# EAGLE design stepper1 (EAGLE 6.6.0)
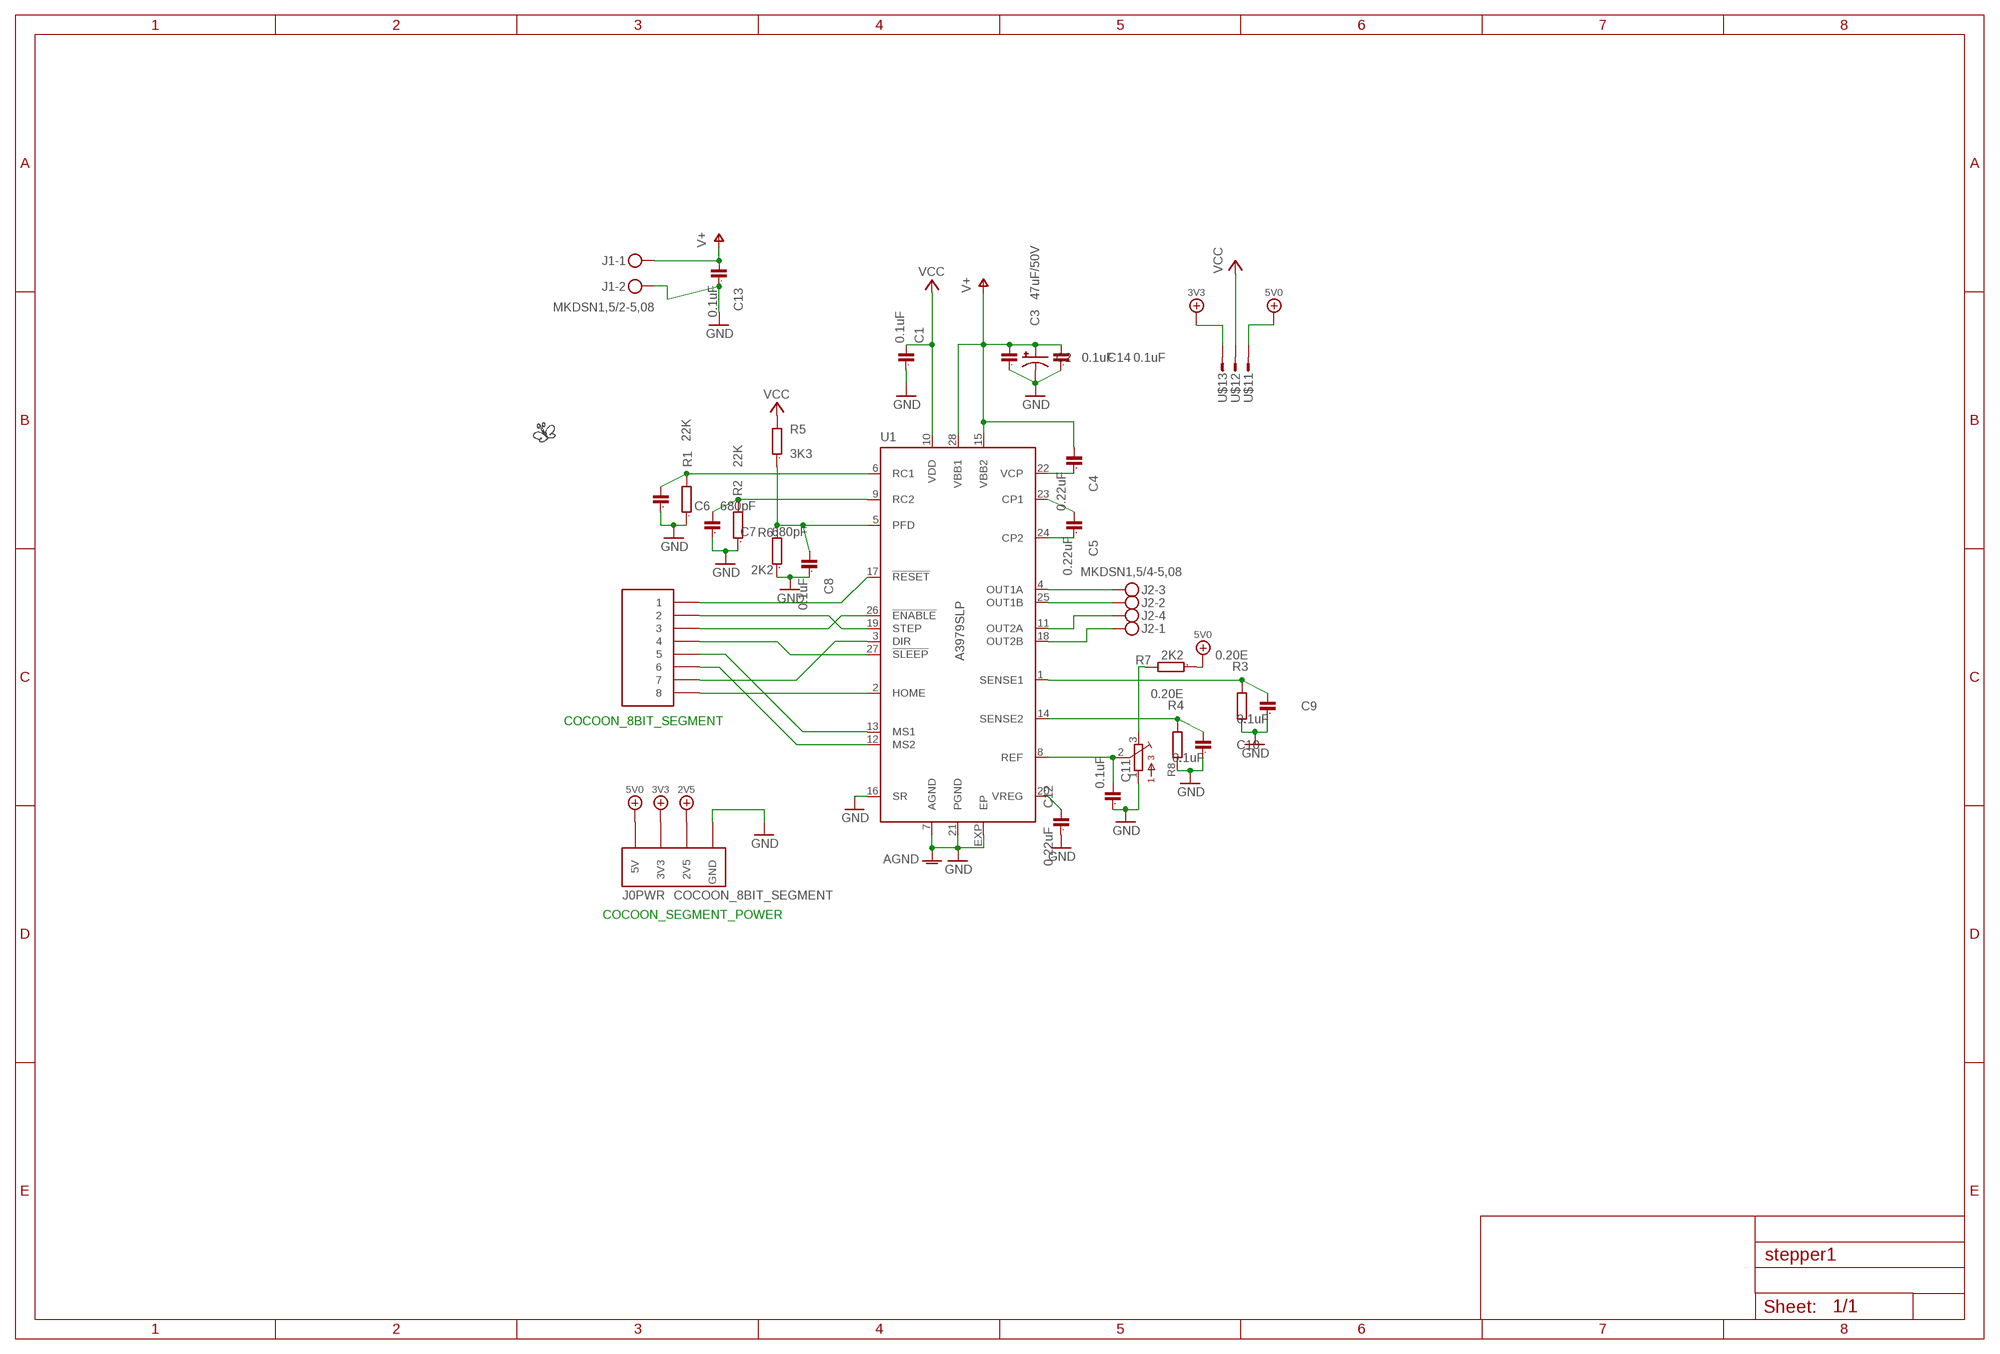
[diagram p0: schematic, sheet 1]

## Parts
C1  0.1uF  C0603  [0603]
C2  0.1uF  C0805  [0805]
C3  47uF/50V  CPOL-USE2.5-7  [E2,5-7]
C4  0.22uF  C0805  [0805]
C5  0.22uF  C0805  [0805]
C6  680pF  C0603  [0603]
C7  680pF  C0603  [0603]
C8  0.1uF  C0603  [0603]
C9  0.1uF  C0805  [0805]
C10  0.1uF  C0805  [0805]
C11  0.1uF  C0603  [0603]
C12  0.22uF  C0805  [0805]
C13  0.1uF  C0805  [0805]
C14  0.1uF  C0805  [0805]
J0  COCOON_8BIT_SEGMENT  [COCOON_8BIT_SEGMENT]
J1  MKDSN1,5/2-5,08  [MKDSN1,5/2-5,08]
J2  MKDSN1,5/4-5,08  [MKDSN1,5/4-5,08]
LOGO1  BUTTERFLY_LOGO  [BUTTERFLY_LOGO]
R1  22K  R0603  [0603]
R2  22K  R0603  [0603]
R3  0.20E  R2512  [2512]
R4  0.20E  R2512  [2512]
R5  3K3  R0603  [0603]
R6  2K2  R0603  [0603]
R7  2K2  R0603  [0603]
R8  3386-P  [3386P]
U1  A3979SLP  [TSSOP28]
U$1  JPS3X1  [JP3X1]

## Nets
2V5: J0.2V5(PWR:2V5)
3V3: J0.3V3(PWR:3V3) U$1.3
5V0: J0.5V(PWR:5V) R7.1 U$1.1
GND: C1.1 C2.1 C3.- C6.1 C7.1 C8.1 C9.1 C10.1 C11.1 C12.1 C13.1 C14.1 J0.GND(PWR:GND) J1.2 R1.1 R2.1 R3.1 R4.1 R6.1 R8.1 U1.7(AGND) U1.16(SR) U1.21(PGND) U1.EXP(EP) ; supply symbol labelled AGND
N$1: R7.2 R8.3
N$2: C6.2 R1.2 U1.6(RC1)
N$3: C7.2 R2.2 U1.9(RC2)
N$4: J0.6 U1.12(MS2)
N$5: C4.1 U1.22(VCP)
N$6: J0.4 U1.27(!SLEEP)
N$7: C11.2 R8.2 U1.8(REF)
N$8: C9.2 R3.2 U1.1(SENSE1)
N$9: C10.2 R4.2 U1.14(SENSE2)
N$10: C12.2 U1.20(VREG)
N$11: J0.3 U1.26(!ENABLE)
N$12: J0.2 U1.19(STEP)
N$13: J0.1 U1.17(!RESET)
N$14: C5.1 U1.24(CP2)
N$15: C5.2 U1.23(CP1)
N$17: J0.8 U1.2(HOME)
N$18: J0.5 U1.13(MS1)
N$19: J0.7 U1.3(DIR)
N$20: C8.2 R5.1 R6.2 U1.5(PFD)
OUT1A: J2.3 U1.4(OUT1A)
OUT1B: J2.2 U1.25(OUT1B)
OUT2A: J2.4 U1.11(OUT2A)
OUT2B: J2.1 U1.18(OUT2B)
V+: C2.2 C3.+ C4.2 C13.2 C14.2 J1.1 U1.15(VBB2) U1.28(VBB1)
VCC: C1.2 R5.2 U1.10(VDD) U$1.2

## Notes on the sheet
- COCOON_8BIT_SEGMENT
- COCOON_SEGMENT_POWER

## Library data of the parts
C1 C2 C4-C14 = GadgetFactory:C: CAPACITOR, European symbol
C3 = GadgetFactory:CPOL-US: POLARIZED CAPACITOR, American symbol
J0 = GadgetFactory_Pub6:COCOON_8BIT_SEGMENT
J1 = usb1:MKDSN1,5/2-5,08: MKDSN 1,5/ 2-5,08 Printklemme Nennstrom: 13,5 A Nennspannung: 250 V Rastermaß: 5,08 mm Polzahl: 2 Anschlussart: Schraubanschluss Montage: Löten Anschlussrichtung Leiter/Platine: 0 ° Artikelnummer: 1729128 Source: http://eshop.phoenixcontact.com .. 1729128.pdf
J2 = usb1:MKDSN1,5/4-5,08: MKDSN 1,5/ 4-5,08 Printklemme Nennstrom: 13,5 A Nennspannung: 250 V Rastermaß: 5,08 mm Polzahl: 4 Anschlussart: Schraubanschluss Montage: Löten Anschlussrichtung Leiter/Platine: 0 ° Artikelnummer: 1729144 Source: http://eshop.phoenixcontact.com .. 1729144.pdf
LOGO1 = usb1:BUTTERFLY_LOGO
R1-R7 = GadgetFactory:R: RESISTOR, European symbol
R8 = GadgetFactory:3386-: 3386 Series 3/8" Square Trimmer
U1 = stepper:A3979SLP
U$1 = stepper:JPS3X1

## Board
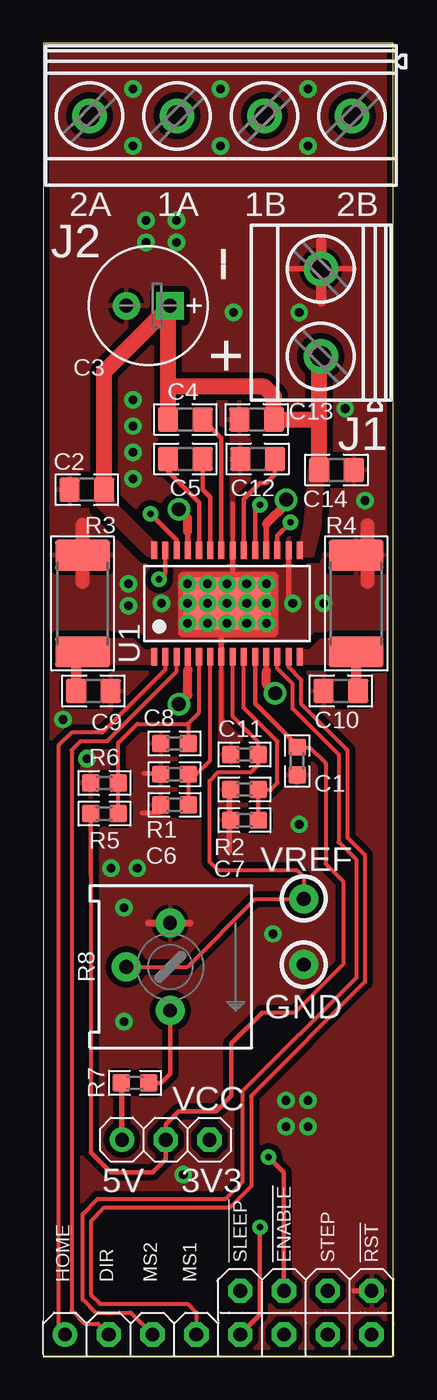
[diagram p1: board, top side]
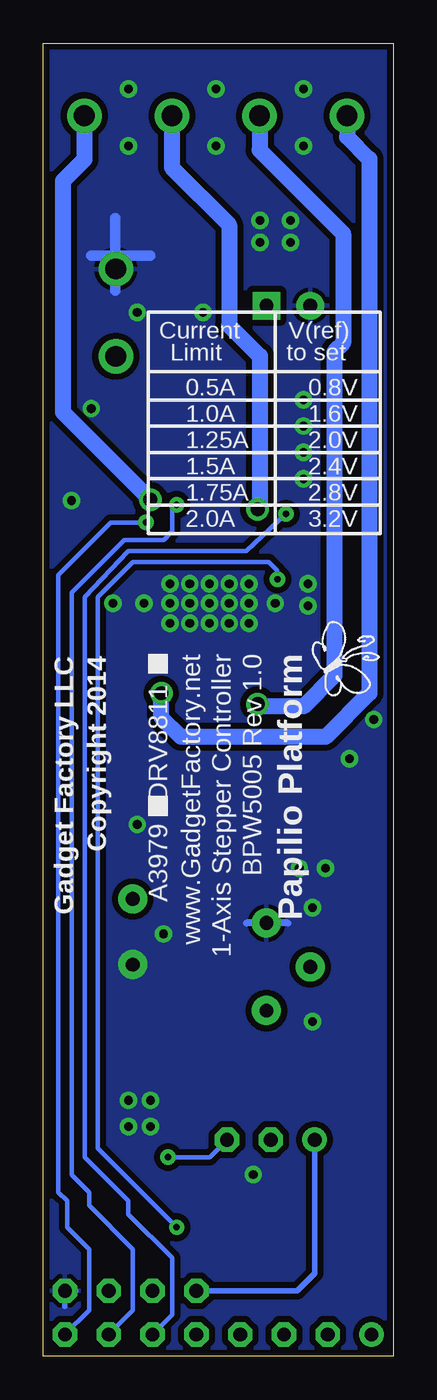
[diagram p2: board, bottom side, seen from below]

Size 20.32 x 76.2 mm. Coordinates in mm from the lower left corner, seen from the top.
Outline: 0,0 20.32,0 20.32,76.2 0,76.2 0,0
Copper layers (1*16): Top 0.035mm / dielectric 1.5mm / Bottom 0.035mm
Design rules "SparkFun_Derived_GoldePheonix_7mil": minimum track width 7mil, minimum drill 15mil, track to track 7mil, track to pad 7mil, pad to pad 7mil, via to via 7mil, smd to smd 7mil, copper to edge 7mil, drill to drill 7mil, minimum pad ring 12mil, minimum via ring 10mil, stop-mask expansion 4mil, vias tented up to drill 18mil, thermal gap 10mil

### Footprints (pad centres in the part's own frame; a part is rotated, then mirrored left to right if it is on the bottom)
0603 = smd 1 x 1: 1 -0.8,0; 2 0.8,0
0805 = smd 1.2 x 1.4: 1 -1,0; 2 1,0
E2,5-7 = drill 0.8 pad 1.6 square: + -1.27,0 | drill 0.8 pad 1.6: - 1.27,0
COCOON_8BIT_SEGMENT = drill 0.8 octagon: 1 -1.27,-8.89; 2 -1.27,-6.35; 2V5 1.27,-6.35; 3 -1.27,-3.81; 3V3 1.27,-3.81; 4 -1.27,-1.27; 5 -1.27,1.27; 5V 1.27,-1.27; 6 -1.27,3.81; 7 -1.27,6.35; GND 1.27,-8.89 | drill 0.8: 8 -1.27,8.89
MKDSN1,5/2-5,08 = drill 1.2 pad 2: 1 -2.561,0.025; 2 2.519,0.025
MKDSN1,5/4-5,08 = drill 1.2 pad 2: 1 -7.641,0.025; 2 -2.561,0.025; 3 2.519,0.025; 4 7.599,0.025
2512 = smd 1.8 x 3.2: 1 -2.8,0; 2 2.8,0
3386P = drill 0.8 pad 1.676: 1 -2.54,0; 2 0,-2.54; 3 2.54,0
TSSOP28 = smd 0.35 x 1: 1 -4.225,-3.087; 2 -3.575,-3.087; 3 -2.925,-3.087; 4 -2.275,-3.087; 5 -1.625,-3.087; 6 -0.975,-3.087; 7 -0.325,-3.087; 8 0.325,-3.087; 9 0.975,-3.087; 10 1.625,-3.087; 11 2.275,-3.087; 12 2.925,-3.087; 13 3.575,-3.087; 14 4.225,-3.087; 15 4.225,3.087; 16 3.575,3.087; 17 2.925,3.087; 18 2.275,3.087; 19 1.625,3.087; 20 0.975,3.087; 21 0.325,3.087; 22 -0.325,3.087; 23 -0.975,3.087; 24 -1.625,3.087; 25 -2.275,3.087; 26 -2.925,3.087; 27 -3.575,3.087; 28 -4.225,3.087 | smd 5 x 3: EXP 0,0
JP3X1 = drill 0.8: 1 0,2.54 | drill 0.8 octagon: 2 0,0; 3 0,-2.54

### Placement (x,y rotation side)
C1  14.73,34.54 90 top
C2  2.54,50.29 0 top
C3  6.1,60.96 180 top
C4  8.25,54.36 180 top
C5  8.25,52.07 0 top
C6  7.62,32 0 top
C7  11.68,31.12 0 top
C8  7.62,35.56 0 top
C9  2.92,38.61 180 top
C10  17.27,38.61 0 top
C11  11.68,34.92 0 top
C12  12.45,52.07 0 top
C13  12.38,54.36 0 top
C14  17.02,51.43 180 top
J0  10.16,2.54 90 top
J1  16.13,60.58 90 top
J2  10.29,72.01 180 top
LOGO1  3.3,40.39 270 bottom
R1  7.62,33.78 0 top
R2  11.68,32.89 0 top
R3  2.29,43.69 270 top
R4  18.16,43.69 270 top
R5  3.56,31.5 180 top
R6  3.56,33.27 0 top
R7  5.33,15.87 0 top
R8  7.37,22.61 270 top
U1  10.67,43.69 0 top
U$1  7.11,12.57 90 top

### Tracks (layer width: path | path; a pad name or v marks a point on that pad's centre or on a via)
3V3  (via drill 0.38)
  Top 0.254: J0.3V3 13.97,10.67 v13.08,11.56
  Bottom 0.254: v13.08,11.56 10.67,11.56 U$1.3
5V0
  Top 0.305: U$1.1 4.57,15.84 R7.1
  Bottom 0.305: J0.5V 5.59,3.81 4.57,4.83 U$1.1
GND  (via drill 0.5, 0.8 pad 1.68)
  Top 0.254: 10.34,36.65 U1.7 | U1.21 10.99,49.47 | 6.86,33.82 5.84,33.82 | 6.73,31.54 5.71,31.54
  Top 0.305: 14.24,43.71 U1.16 | 18.03,3.81 19.43,3.81 | 14.22,63.12 18.03,63.12 | 10.79,29.34 10.79,32.89 | U1.21 10.99,44.83 v10.67,44.83 | U1.7 10.34,42.54 v10.67,42.54 | 8.13,44.83 v8.38,44.83
  Top 0.406: 6.12,25.15 8.53,25.15
  Top 0.61: 16.13,61.21 16.13,64.64 | 13.33,42.16 13.33,45.21 8.13,45.21 8.13,44.83 8.13,42.04 13.33,42.04
  Top 0.813: 2.29,44.96 2.29,48.26 | 18.82,44.93 18.82,48.23
  Bottom 0.305: J0.GND 19.05,2.92 | J0.GND 18.42,3.81 | J0.GND 19.56,3.81
  Bottom 0.406: 6.12,25.15 8.53,25.15
  Bottom 0.61: 16.13,61.85 16.13,66.04 | 14.1,63.88 17.53,63.88
  other vias: 5.46,28.32 15.37,70.23 5.21,53.97 4.7,26.04 8.38,42.54 8.38,43.69 11.81,42.54 9.52,42.54 5.21,73.53 12.95,42.54 14.48,43.69 6.86,43.69 15.37,73.53 7.75,65.91 15.37,13.33 3.94,28.32 8.13,10.54 5.21,50.93 9.52,43.69 10.67,43.69 11.81,43.69 12.95,43.69 9.52,44.83 11.81,44.83 12.95,44.83 16.26,43.69 4.95,43.56 13.33,24.51 14.1,14.86 5.97,64.64 11.05,60.58 14.1,13.33 15.37,14.86 5.97,65.91 18.67,49.66 7.75,64.64 10.29,73.53 14.86,60.58 5.21,52.45 10.29,70.23 4.7,19.43 2.54,34.67 17.53,54.99 5.21,55.5 1.14,36.96 14.86,30.86 4.95,44.83 5.21,70.23 15.11,22.73
  pour Top (isolate 0.356, rank 3): 0,76.2 0,0 20.32,0 20.32,76.2
  pour Bottom (isolate 0.356): 0,0 0,76.2 20.32,76.2 20.32,0
N$1
  Top 0.254: R8.3 7.37,16.38 6.86,15.87 R7.2
N$2
  Top 0.229: U1.6 9.69,34.59 8.89,33.78 R1.2 C6.2
N$3
  Top 0.229: U1.9 11.64,37.63 13.59,35.69 13.59,33.27 13.21,32.89 R2.2
  Top 0.254: C7.2 R2.2
N$4
  Top 0.229: J0.6 5.08,2.54 3.05,2.54 2.29,3.3 2.29,8.25 3.17,9.14 10.59,9.14 11.56,10.11 11.56,15.37 18.16,21.97 18.16,28.83 17.14,29.85 17.14,34.92 14.48,37.59 14.48,39.01 13.59,39.9 U1.12
N$5
  Top 0.254: U1.22 10.34,53.27 C4.1
N$6  (via drill 0.38)
  Top 0.254: U1.27 7.09,45.45 v6.73,45.09 | v12.57,7.49 12.57,2.41 J0.4
  Bottom 0.254: v12.57,7.49 17.14,12.06 17.14,44.07 15.11,46.1 7.24,46.1 6.73,45.59 v6.73,45.09
N$7  (via drill 0.8 pad 1.68)
  Top 0.229: U1.8 10.99,37.14 12.48,35.65 C11.2 12.48,34.33 12.06,33.91 10.16,33.91 9.65,33.4 9.65,28.7 10.16,28.19 14.73,28.19 15.11,27.81 v15.11,26.54 12.32,26.54 8.38,22.61 R8.2
N$8
  Top 0.61: C9.2 1.92,40.52 R3.2
  pour Top (no thermals): 2.29,40.26 6.48,40.26 6.48,40.89 5.84,40.89 5.21,41.53 2.29,41.53
N$9
  Top 0.61: R4.2 18.16,38.72 C10.2
  pour Top (no thermals): 19.05,40.26 14.86,40.26 14.86,40.89 15.49,40.89 16.13,41.53 19.05,41.53
N$10
  Top 0.254: U1.20 11.64,49.74 12.57,50.67 12.95,50.67 13.45,51.16 C12.2
N$11  (via drill 0.38)
  Top 0.254: U1.26 7.74,47.38 v6.22,48.89
  Bottom 0.254: v6.22,48.89 8.53,46.74 15.39,46.74 17.91,44.07 17.91,11.56 15.37,9.02 15.37,8.25 12.83,5.71 12.83,2.41 J0.3
N$12  (via drill 0.38)
  Top 0.254: U1.19 12.29,49.12 v12.57,49.4
  Bottom 0.254: v12.57,49.4 12.83,49.15 12.83,47.88 13.33,47.37 15.62,47.37 18.67,44.32 18.67,10.54 17.65,9.52 17.65,8.76 15.11,6.22 15.11,2.67 J0.2
N$13  (via drill 0.38)
  Top 0.254: U1.17 13.59,47.63 v14.35,48.39
  Bottom 0.254: v14.35,48.39 16.38,48.39 19.43,45.34 19.43,9.52 18.92,9.02 18.92,7.49 17.65,6.22 17.65,2.67 J0.1
N$14
  Top 0.254: U1.24 9.04,49.55 7.25,51.34 C5.1
N$15
  Top 0.254: U1.23 9.69,49.87 9.25,50.31 C5.2
N$17
  Top 0.229: 7.11,40.58 7.11,39.88 3.43,36.2 1.65,36.2 0.89,35.43 0.89,1.65 J0.8
  Top 0.254: 7.11,40.58 U1.2
N$18
  Top 0.229: U1.13 14.24,39.99 14.99,39.24 14.99,37.85 17.65,35.18 17.65,30.1 18.67,29.08 18.67,21.72 12.06,15.11 12.06,9.85 10.85,8.64 3.56,8.64 2.79,7.87 2.79,3.56 3.3,3.05 8.38,3.05 8.89,2.54 J0.5
N$19
  Top 0.229: U1.3 7.74,39.75 3.68,35.69 2.16,35.69 1.65,35.18 1.65,2.67 2.41,1.91 3.17,1.91 J0.7
N$20
  Top 0.229: U1.5 9.04,37.36 8.38,36.7 | R5.1 R6.2 4.36,35.6 5.46,36.7 8.38,36.7 | C8.2 8.42,36.66 8.38,36.7
OUT1A  (via drill 0.8 pad 0.3)
  Top 0.33: U1.4 8.39,39.83
  Top 0.508: v7.87,37.85 8.39,38.37 8.39,39.83
  Bottom 0.914: v7.87,37.85 7.75,37.72 5.21,37.72 3.43,39.5 3.43,58.29 2.92,58.8 2.92,65.15 7.77,70 J2.3
OUT1B  (via drill 0.8 pad 0.3)
  Top 0.33: U1.25 8.39,47.87 8.38,47.88
  Top 0.508: 8.38,47.88 8.38,48.64 v7.87,49.15
  Bottom 0.914: J2.2 12.85,68.98 9.52,65.66 9.52,59.82 7.75,58.04 7.75,49.28 v7.87,49.15
OUT2A  (via drill 0.8 pad 0.3)
  Top 0.33: U1.11 12.94,39.76 12.95,39.75
  Top 0.508: 12.95,39.75 12.95,38.99 v13.46,38.48
  Bottom 0.914: v13.46,38.48 13.46,37.08 12.32,35.94 3.94,35.94 1.4,38.48 1.4,58.29 1.4,59.31 1.4,69.47 2.69,70.76 J2.4
OUT2B  (via drill 0.8 pad 0.3)
  Top 0.33: U1.18 12.95,46.79 12.95,48.31
  Top 0.508: v14.1,49.71 14.1,49.45 12.95,48.31
  Bottom 0.914: J2.1 17.93,69.45 19.18,68.2 19.18,54.79 v14.1,49.71
V+
  Top 0.914: C2.2 3.54,57.13 C3.+ 7.25,60.85 7.25,56.52 | C4.2 7.25,56.52 | 7.25,56.52 7.51,56.26 12.83,56.26 13.38,55.71 C13.2 15.89,54.36 16.02,54.48 | C14.2 16.02,54.48 | 16.02,54.48 16.02,57.93 J1.1
  pour Top (no thermals): 16.26,51.56 16,48.13 15.62,46.48 14.86,46.48 14.86,47.05 14.99,47.05 15.24,48.32 15.49,51.56
  pour Top (no thermals): 6.48,46.48 6.48,47.12 3.94,49.66 3.94,50.55 3.17,50.55 3.17,49.4 6.1,46.48
VCC
  Top 0.229: 2.76,27.98 R5.2 2.76,11.85 2.79,11.81 | C1.2 15.46,35.34 16.38,34.42 16.38,28.58 17.4,27.56 17.4,22.73 14.6,19.94 12.7,19.94
  Top 0.254: 2.79,11.81 3.94,10.67 6.35,10.67 7.11,11.43 U$1.2 7.11,13.46 7.87,14.22 10.03,14.22 10.92,15.11 10.92,18.16 12.7,19.94 | 14.73,35.43 12.29,37.87 U1.10
  Top 0.305: C1.2 14.73,35.43

### Text on the board
tPlace: 2A | 1A | 1B | 2B | - | - | + | 5V | 3V3 | !SLEEP | !ENABLE | STEP | !RST | HOME | DIR | MS2 | MS1
bPlace: Papilio Platform | BPW5005 Rev 1.0 | 1-Axis Stepper Controller | www.GadgetFactory.net | Copyright 2014 | Gadget Factory LLC | A3979 DRV8811
tNames: VREF | GND | VCC
bNames: V(ref) | Current | to set | Limit | 0.8V | 0.5A | 1.6V | 1.0A | 2.0V | 1.25A | 2.4V | 1.5A | 2.8V | 1.75A | 3.2V | 2.0A
Measures: 40.6 mm | 76.2 mm
Reference: - | Motor supply +24V | +